# Altium schematic sheet STM32f407.SchDoc
size A3; SheetNumber: 10; SheetTotal: 12
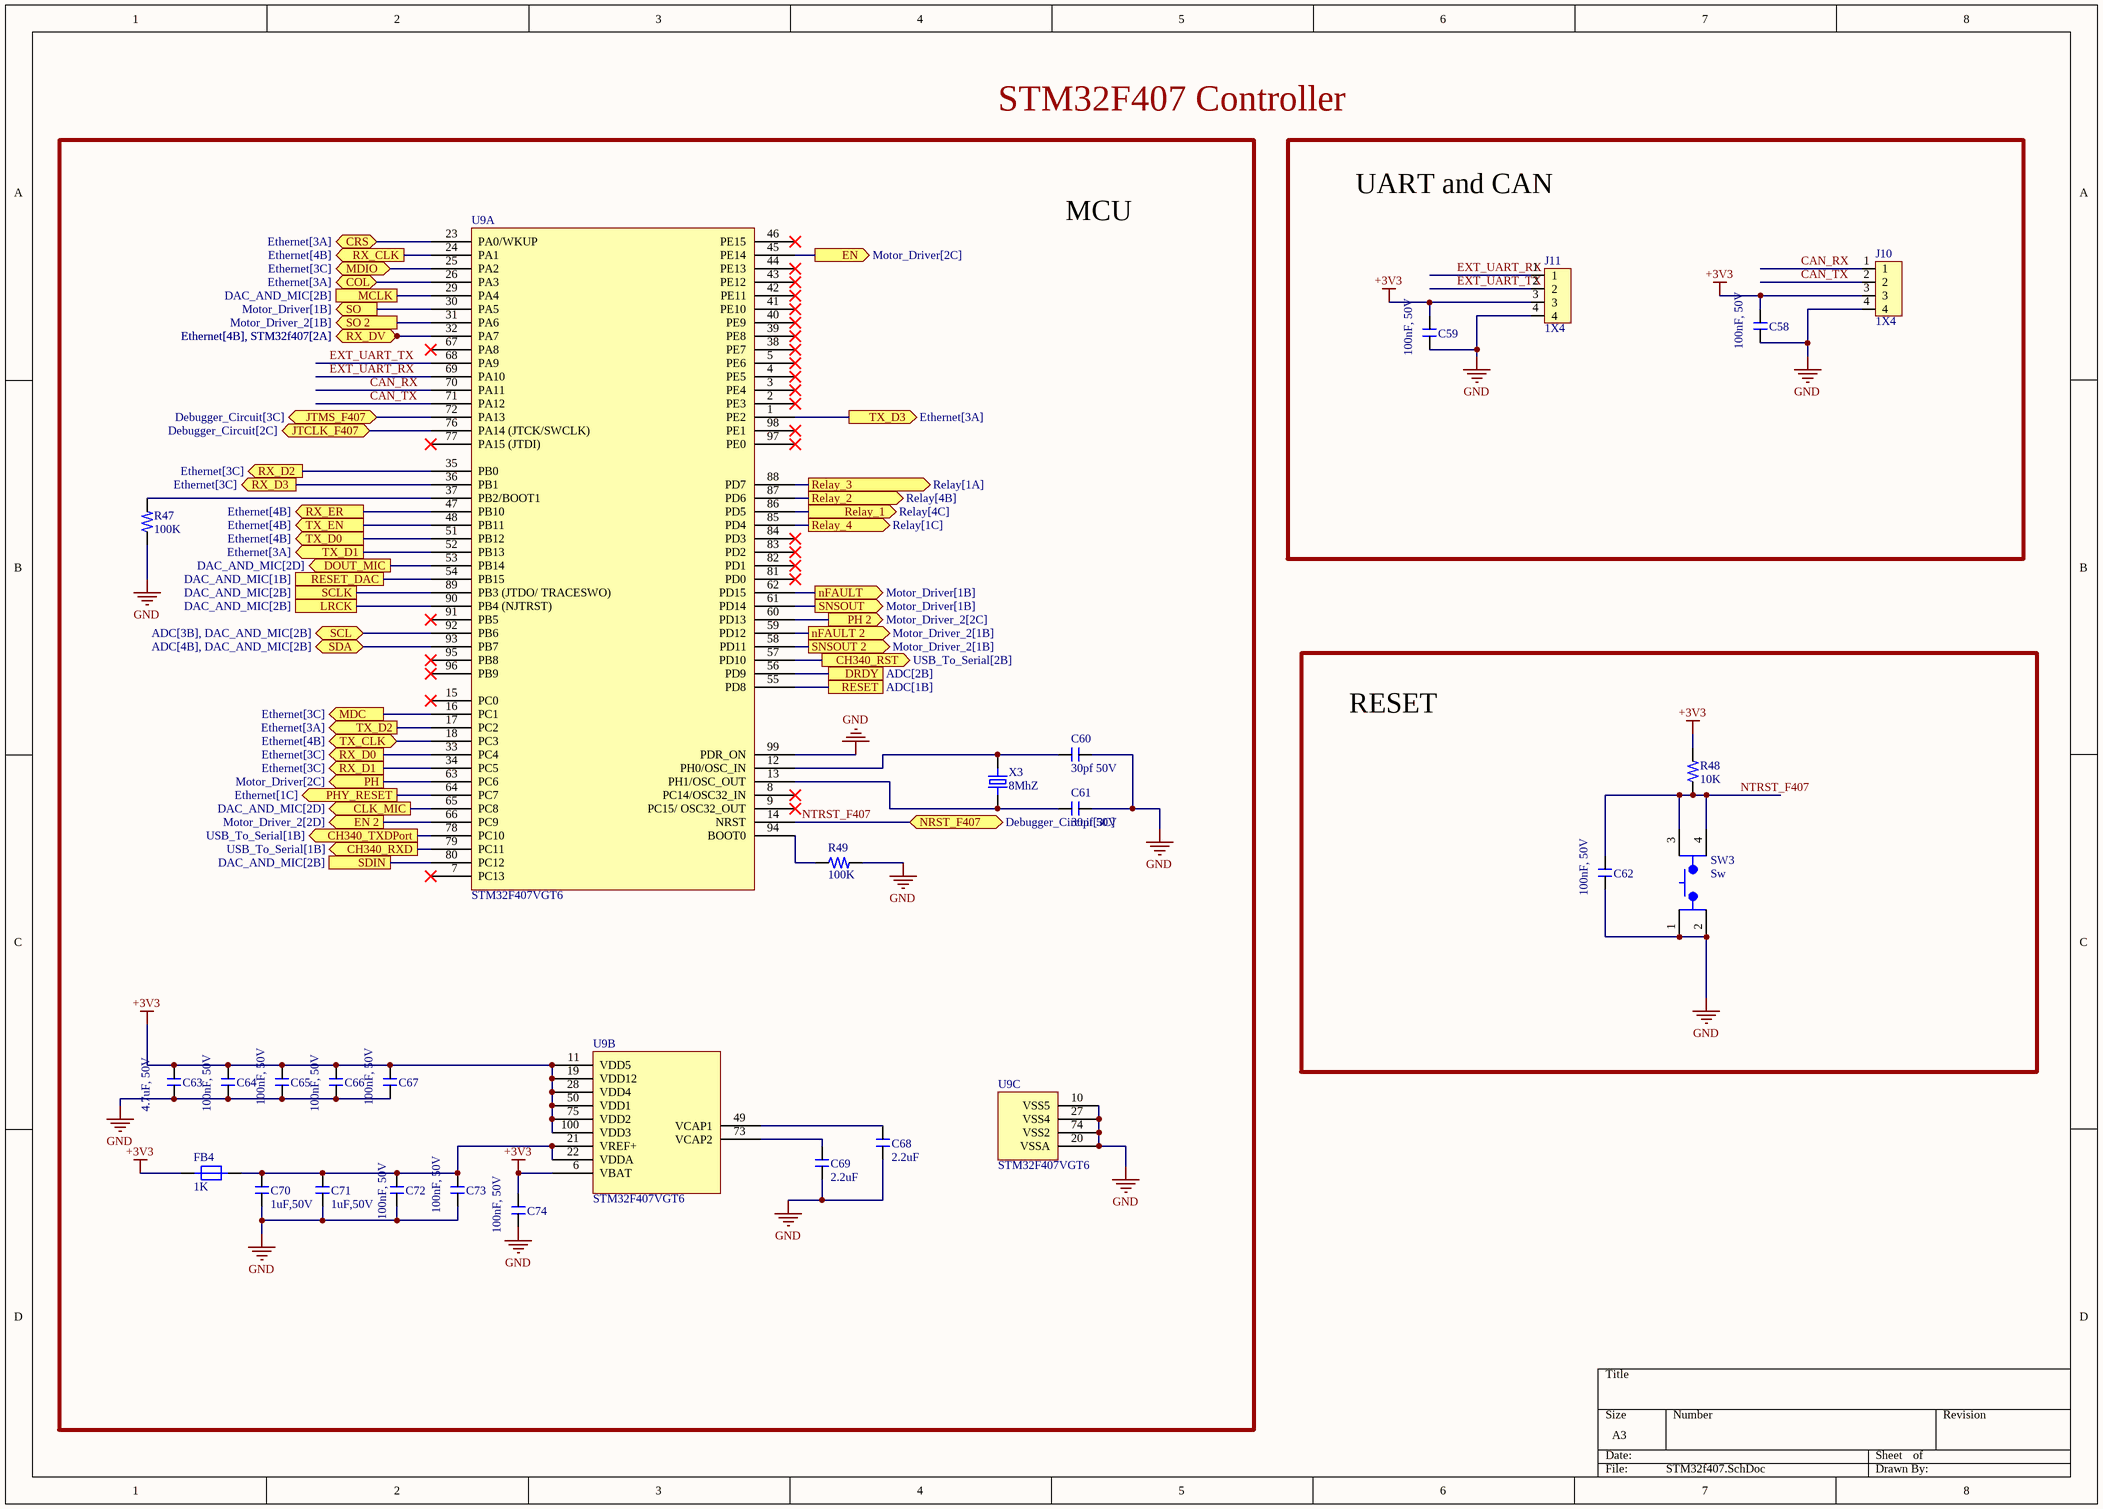
[diagram p0: STM32f407.SchDoc]

## Parts
C58  100nF, 50V  [Capacitor_0805]
C59  100nF, 50V  [Capacitor_0805]
C60  30pf 50V  [Capacitor_0805]
C61  30pf 50V  [Capacitor_0805]
C62  100nF, 50V  [Capacitor_0805]
C63  4.7uF, 50V  [Capacitor_0805]
C64  100nF, 50V  [Capacitor_0805]
C65  100nF, 50V  [Capacitor_0805]
C66  100nF, 50V  [Capacitor_0805]
C67  100nF, 50V  [Capacitor_0805]
C68  2.2uF  [Capacitor_0805]
C69  2.2uF  [Capacitor_0805]
C70  1uF,50V  [Capacitor_0805]
C71  1uF,50V  [Capacitor_0805]
C72  100nF, 50V  [Capacitor_0805]
C73  100nF, 50V  [Capacitor_0805]
C74  100nF, 50V  [Capacitor_0805]
FB4  1K  [FB_0805]
J10  1X4  [Header_1X4_2.54mm]
J11  1X4  [Header_1X4_2.54mm]
R47  100K  [Resistor_0603]
R48  10K  [Resistor_0603]
R49  100K  [Resistor_0603]
SW3  Sw  [SW_Tactile_SMD]
U9  STM32F407VGT6  [QFN100_19.6_669_58X10_SMD]  (parts A,B,C of 3)
X3  8MhZ  [XTAL_8MhZ]

## Blocks framed on the sheet
MCU: C60 C61 C63-C74 FB4 R47 R49 U9 X3
UART and CAN: C58 C59 J10 J11
RESET: C62 R48 SW3

## Ports
CH340_RST (out, see USB_To_Serial[2B]), CH340_RXD (out, see USB_To_Serial[1B]), CH340_TXDPort (out, see USB_To_Serial[1B]), CLK_MIC (out, see DAC_AND_MIC[2D]), COL (bidir, see Ethernet[3A]), CRS (bidir, see Ethernet[3A]), DOUT_MIC (out, see DAC_AND_MIC[2D]), DRDY (see ADC[2B]), EN 2 (out, see Motor_Driver_2[2D]), EN (out, see Motor_Driver[2C]), JTCLK_F407 (bidir, see Debugger_Circuit[2C]), JTMS_F407 (bidir, see Debugger_Circuit[3C]), LRCK (see DAC_AND_MIC[2B]), MCLK (see DAC_AND_MIC[2B]), MDC (out, see Ethernet[3C]), MDIO (bidir, see Ethernet[3C]), nFAULT 2 (out, see Motor_Driver_2[1B]), nFAULT (out, see Motor_Driver[1B]), NRST_F407 (bidir, see Debugger_Circuit[3C]), PH 2 (out, see Motor_Driver_2[2C]), PH (out, see Motor_Driver[2C]), PHY_RESET (out, see Ethernet[1C]), Relay_1 (out, see Relay[4C]), Relay_2 (out, see Relay[4B]), Relay_3 (out, see Relay[1A]), Relay_4 (out, see Relay[1C]), RESET (see ADC[1B]), RESET_DAC (see DAC_AND_MIC[1B]), RX_CLK (out, see Ethernet[4B]), RX_D0 (out, see Ethernet[3C]), RX_D1 (out, see Ethernet[3C]), RX_D2 (out, see Ethernet[3C]), RX_D3 (out, see Ethernet[3C]), RX_DV (bidir, see Ethernet[4B], STM32f407[2A]), RX_ER (out, see Ethernet[4B]), SCL (bidir, see ADC[3B], DAC_AND_MIC[2B]), SCLK (see DAC_AND_MIC[2B]), SDA (bidir, see ADC[4B], DAC_AND_MIC[2B]), SDIN (see DAC_AND_MIC[2B]), SNSOUT 2 (out, see Motor_Driver_2[1B]), SNSOUT (out, see Motor_Driver[1B]), SO 2 (out, see Motor_Driver_2[1B]), SO (out, see Motor_Driver[1B]), TX_CLK (bidir, see Ethernet[4B]), TX_D0 (out, see Ethernet[4B]), TX_D1 (out, see Ethernet[3A]), TX_D2 (out, see Ethernet[3A]), TX_D3 (out, see Ethernet[3A]), TX_EN (out, see Ethernet[4B])

## Nets
+3V3: C58.2 C59.2 C63.2 C64.2 C65.2 C66.2 C67.2 C74.2 FB4.1 J10.3 J11.3 R48.2 U9.6(VBAT) U9.11(VDD5) U9.19(VDD12) U9.28(VDD4) U9.50(VDD1) U9.75(VDD2) U9.100(VDD3)
GND: C58.1 C59.1 C60.1 C61.1 C62.1 C63.1 C64.1 C65.1 C66.1 C67.1 C68.1 C69.1 C70.1 C71.1 C72.1 C73.1 C74.1 J10.4 J11.4 R47.1 R49.2 SW3.1 SW3.2 U9.10(VSS5) U9.20(VSSA) U9.27(VSS4) U9.74(VSS2) U9.99(PDR_ON)
CAN_RX: J10.1 U9.70(PA11)
CAN_TX: J10.2 U9.71(PA12)
CH340_RST: U9.57(PD10) ; port CH340_RST
CH340_RXD: U9.79(PC11) ; port CH340_RXD
CH340_TXDPort: U9.78(PC10) ; port CH340_TXDPort
CLK_MIC: U9.65(PC8) ; port CLK_MIC
COL: U9.26(PA3) ; port COL
CRS: U9.23(PA0/WKUP) ; port CRS
DOUT_MIC: U9.53(PB14) ; port DOUT_MIC
DRDY: U9.56(PD9) ; port DRDY
EN: U9.45(PE14) ; port EN
EN 2: U9.66(PC9) ; port EN 2
EXT_UART_RX: J11.1 U9.69(PA10)
EXT_UART_TX: J11.2 U9.68(PA9)
JTCLK_F407: U9.76(PA14_(JTCK/SWCLK)) ; port JTCLK_F407
JTMS_F407: U9.72(PA13) ; port JTMS_F407
LRCK: U9.90(PB4_(NJTRST)) ; port LRCK
MCLK: U9.29(PA4) ; port MCLK
MDC: U9.16(PC1) ; port MDC
MDIO: U9.25(PA2) ; port MDIO
nFAULT: U9.62(PD15) ; port nFAULT
nFAULT 2: U9.59(PD12) ; port nFAULT 2
NTRST_F407: C62.2 R48.1 SW3.3 SW3.4 U9.14(NRST) ; port NRST_F407
PH: U9.63(PC6) ; port PH
PH 2: U9.60(PD13) ; port PH 2
PHY_RESET: U9.64(PC7) ; port PHY_RESET
Relay_1: U9.86(PD5) ; port Relay_1
Relay_2: U9.87(PD6) ; port Relay_2
Relay_3: U9.88(PD7) ; port Relay_3
Relay_4: U9.85(PD4) ; port Relay_4
RESET: U9.55(PD8) ; port RESET
RESET_DAC: U9.54(PB15) ; port RESET_DAC
RX_CLK: U9.24(PA1) ; port RX_CLK
RX_D0: U9.33(PC4) ; port RX_D0
RX_D1: U9.34(PC5) ; port RX_D1
RX_D2: U9.35(PB0) ; port RX_D2
RX_D3: U9.36(PB1) ; port RX_D3
RX_DV: U9.32(PA7) ; port RX_DV
RX_ER: U9.47(PB10) ; port RX_ER
SCL: U9.92(PB6) ; port SCL
SCLK: U9.89(PB3_(JTDO/_TRACESWO)) ; port SCLK
SDA: U9.93(PB7) ; port SDA
SDIN: U9.80(PC12) ; port SDIN
SNSOUT: U9.61(PD14) ; port SNSOUT
SNSOUT 2: U9.58(PD11) ; port SNSOUT 2
SO: U9.30(PA5) ; port SO
SO 2: U9.31(PA6) ; port SO 2
TX_CLK: U9.18(PC3) ; port TX_CLK
TX_D0: U9.51(PB12) ; port TX_D0
TX_D1: U9.52(PB13) ; port TX_D1
TX_D2: U9.17(PC2) ; port TX_D2
TX_D3: U9.1(PE2) ; port TX_D3
TX_EN: U9.48(PB11) ; port TX_EN
NetC60_2: C60.2 U9.12(PH0/OSC_IN) X3.2
NetC61_2: C61.2 U9.13(PH1/OSC_OUT) X3.1
NetC68_2: C68.2 U9.49(VCAP1)
NetC69_2: C69.2 U9.73(VCAP2)
NetC70_2: C70.2 C71.2 C72.2 C73.2 FB4.2 U9.21(VREF+) U9.22(VDDA)
NetR47_2: R47.2 U9.37(PB2/BOOT1)
NetR49_1: R49.1 U9.94(BOOT0)

Not connected (* = marked no-connect by the designer): U9 2(PE3)* 3(PE4)* 4(PE5)* 5(PE6)* 7(PC13)* 8(PC14/OSC32_IN)* 9(PC15/_OSC32_OUT)* 15(PC0)* 38(PE7)* 39(PE8)* 40(PE9)* 41(PE10)* 42(PE11)* 43(PE12)* 44(PE13)* 46(PE15)* 67(PA8)* 77(PA15_(JTDI))* 81(PD0)* 82(PD1)* 83(PD2)* 84(PD3)* 91(PB5)* 95(PB8)* 96(PB9)* 97(PE0)* 98(PE1)*

## Notes on the sheet
- STM32F407 Controller

## Library data of the parts
C58 C59 C62 C64-C67 C72-C74 = Cap_100nF_0805: Multilayer Ceramic Capacitor, 0.1 uF, 50 V, ï¿½ 10%, X7R, 0805 [2012 Metric]; Manufacturer: Samsung; Manufacturer Part Number: CL21B104KBCNNNC; Supplier: Digikey; Supplier Part Number: 1276-1003-1-ND; RoHS: Yes; Category: Ceramic Capacitors; Stock: 674609; Pricing: 1=0,08, 10=0,012, 100=0,0104, 1000=0,008 (USD); Mounting Technology: Surface Mount; Case/Package: 0805; Case Code (Metric): 2012; Case Code (Imperial): 0805; Material: Ceramic; Min Operating Temperature: -55°C; Max Operating Temperature: 125°C; Tolerance: 10%; Value: 100nF; Dielectric: X7R; Packaging: Tape and Reel; Voltage Rating: 50V; Voltage: 50V; Series: CL; Construction: Flat; Voltage Rating (DC): 50V; Length: 2mm; Width: 0.049inch; Height: 0.85mm; Depth: 1.25mm; Thickness: 0.037inch; Radiation Hardening: No; RoHS Compliant: Yes; Lead Free: 5697LeadFree; ComponentLink1URL: https://datasheet.ciiva.com/25710/cl21b104kbcnnnc-25710182.pdf?src-supplier=Digikey; ComponentLink1Description: https://datasheet.ciiva.com/25710/cl21b104kbcnnnc-25710182.pdf?src-supplier=Digikey; ComponentLink2URL: https://datasheet.ciiva.com/29199/454152-da-01-en-vs-kondensator-0805-29199814.pdf?src-supplier=Conrad; ComponentLink2Description: https://datasheet.ciiva.com/29199/454152-da-01-en-vs-kondensator-0805-29199814.pdf?src-supplier=Conrad
C60 C61 = Cap_30pf_0805: Capacitor, ceramic, 30Pf, 50Vdc, 10-% Tol, 10+% Tol, c0G-Tc Code, -30, 30Ppm-Tc Rohs Compliant: Yes; Manufacturer: KEMET; Manufacturer Part Number: C0805C300K5GACTU; Supplier: Mouser; Supplier Part Number: 80-C0805C300K5G; RoHS: Yes; Category: Ceramic Capacitors; Stock: 2572; Pricing: 1=0,27, 10=0,164, 50=0,164, 100=0,096, 1000=0,077, 10000=0,047 (USD); ComponentLink1URL: http://www.mouser.com/ds/2/212/KEM_C1003_C0G_SMD-1101588.pdf?src-supplier=Mouser; ComponentLink1Description: http://www.mouser.com/ds/2/212/KEM_C1003_C0G_SMD-1101588.pdf?src-supplier=Mouser; ComponentLink2URL: http://components.arrow.com/part/dataview/2091985S8614748N7429?src-supplier=Arrow+Electronics; ComponentLink2Description: http://components.arrow.com/part/dataview/2091985S8614748N7429?src-supplier=Arrow+Electronics; ComponentLink3URL: https://datasheet.octopart.com/C0805C300K5GACTU-KEMET-datasheet-149535491.pdf?src-supplier=Farnell; ComponentLink3Description: https://datasheet.octopart.com/C0805C300K5GACTU-KEMET-datasheet-149535491.pdf?src-supplier=Farnell; ComponentLink4URL: https://search.kemet.com/component-edge/download/datasheet/C0805C300K5GACTU.pdf?src-supplier=Digikey; ComponentLink4Description: https://search.kemet.com/component-edge/download/datasheet/C0805C300K5GACTU.pdf?src-supplier=Digikey
C63 = Cap_4.7uF_0805: Multilayer Ceramic Capacitor, 4.7 uF, 50 V, ï¿½ 10%, X5R, 0805 [2012 Metric]; Manufacturer: Murata; Manufacturer Part Number: GRM21BR61H475KE51L; Supplier: Mouser; Supplier Part Number: 81-GRM21BR61H475KE1L; RoHS: Yes; Category: Ceramic Capacitors; Stock: 172250; Pricing: 1=0,26, 10=0,141, 50=0,141, 100=0,086, 1000=0,083, 10000=0,071 (USD); Mounting Technology: Surface Mount; Case/Package: 0805; Case Code (Metric): 2012; Material: Ceramic; Case Code (Imperial): 0805; Min Operating Temperature: -55°C; Max Operating Temperature: 85°C; Packaging: Tape and Reel; Series: GRM; Value: 4.7uF; Tolerance: 10%; Dielectric: X5R; Voltage Rating: 50V; Voltage Rating (DC): 50V; Length: 2mm; Width: 0.049inch; Height: 1.25mm; Depth: 1.25mm; Thickness: 0.055inch; Reach SVHC Compliant: No; RoHS Compliant: Yes; Lead Free: 5697LeadFree; ComponentLink1URL: http://www.farnell.com/datasheets/2079186.pdf?src-supplier=Farnell; ComponentLink1Description: http://www.farnell.com/datasheets/2079186.pdf?src-supplier=Farnell; ComponentLink2URL: https://datasheet.octopart.com/GRM21BR61H475KE51L-Murata-datasheet-22122223.pdf?src-supplier=Future+Electronics; ComponentLink2Description: https://datasheet.octopart.com/GRM21BR61H475KE51L-Murata-datasheet-22122223.pdf?src-supplier=Future+Electronics; ComponentLink3URL: http://www.farnell.com/datasheets/2079186.pdf?src-supplier=Element14; ComponentLink3Description: http://www.farnell.com/datasheets/2079186.pdf?src-supplier=Element14; ComponentLink4URL: https://datasheet.octopart.com/GRM21BR61H475KE51L-Murata-datasheet-66077112.pdf?src-supplier=Element14; ComponentLink4Description: https://datasheet.octopart.com/GRM21BR61H475KE51L-Murata-datasheet-66077112.pdf?src-supplier=Element14; ComponentLink5URL: http://search.murata.co.jp/Ceramy/image/img/A01X/G101/ENG/GRM21BR61H475KE51-01.pdf?src-supplier=Digikey; ComponentLink5Description: http://search.murata.co.jp/Ceramy/image/img/A01X/G101/ENG/GRM21BR61H475KE51-01.pdf?src-supplier=Digikey; ComponentLink6URL: https://search.murata.co.jp/Ceramy/image/img/A01X/G101/ENG/GRM21BR61H475KE51-01.pdf?src-supplier=Digikey; ComponentLink6Description: https://search.murata.co.jp/Ceramy/image/img/A01X/G101/ENG/GRM21BR61H475KE51-01.pdf?src-supplier=Digikey
C68 C69 = CAP_2.2uF_0805: Multilayer Ceramic Capacitor, 2.2 uF, 25 V, ± 10%, X7R, 0805 [2012 Metric]; Manufacturer: Samsung; Manufacturer Part Number: CL21B225KAFNFNE; Supplier: Arrow Electronics; Supplier Part Number: CL21B225KAFNFNE; RoHS: Yes; Category: Ceramic Capacitors; Stock: 1124000; Pricing: 4000=0,0243, 6000=0,0241, 10000=0,0171, 14000=0,0169, 20000=0,0168, 50000=0,0155, 100000=0,0153, 200000=0,015 (USD); ComponentLink1URL: https://datasheet.ciiva.com/25798/cl21b225kafnfne-25798721.pdf?src-supplier=Digikey; ComponentLink1Description: https://datasheet.ciiva.com/25798/cl21b225kafnfne-25798721.pdf?src-supplier=Digikey
C70 C71 = Cap_1uF_0805: 0805 1 uF 50 V ±5 % Tolerance X7R Surface Mount Multilayer Ceramic Capacitor; Manufacturer: Yageo; Manufacturer Part Number: CC0805JKX7R9BB105; Material: 4241ConductorMaterial; Dielectric: 1511DielectricType; Supplier: Digikey; Supplier Part Number: 311-3498-1-ND; RoHS: Yes; Category: Ceramic Capacitors; Stock: 30160; Pricing: 1=0,29, 10=0,168, 100=0,1077, 1000=0,07673 (USD); Voltage Rating (DC): 50V; Height: 1.45mm; Lead Free: 5697LeadFree; Halogen Free: 5694HalogenFree; ComponentLink1URL: https://datasheet.octopart.com/CC0805JKX7R9BB105-Yageo-datasheet-137700082.pdf?src-supplier=Future+Electronics; ComponentLink1Description: https://datasheet.octopart.com/CC0805JKX7R9BB105-Yageo-datasheet-137700082.pdf?src-supplier=Future+Electronics; ComponentLink2URL: http://www.yageo.com/documents/recent/UPY-GPHC_X7R_6.3V-to-50V_18.pdf?src-supplier=Digikey; ComponentLink2Description: http://www.yageo.com/documents/recent/UPY-GPHC_X7R_6.3V-to-50V_18.pdf?src-supplier=Digikey; ComponentLink3URL: https://datasheet.octopart.com/CC0805JKX7R9BB105-Yageo-datasheet-151948686.pdf?src-supplier=Farnell; ComponentLink3Description: https://datasheet.octopart.com/CC0805JKX7R9BB105-Yageo-datasheet-151948686.pdf?src-supplier=Farnell
FB4 = FB_BLM21SP102SH1D: Ferrite Beads Multi-Layer High Current 1KOhm 25% 100MHz 1.6A 0.12Ohm DCR 0805 Automotive T/R; Manufacturer: Murata; Core Material: 228ConductorMaterial; Value: 120mR; Supplier: Mouser; Supplier Part Number: 81-BLM21SP102SH1D; Manufacturer Part Number: BLM21SP102SH1D; RoHS: Yes; Category: Ferrite Beads and Chips; Stock: 4751; Pricing: 1=0,33, 10=0,179, 50=0,179, 100=0,159, 1000=0,105, 10000=0,083 (USD); RMS Current (Irms): 1.6A; ESR: 120mR; Test Frequency: 100MHz; Tolerance: 25%; Height: 1.05mm; ComponentLink1URL: https://datasheet.octopart.com/BLM21SP102SH1D-Murata-datasheet-138707452.pdf?src-supplier=Future+Electronics; ComponentLink1Description: https://datasheet.octopart.com/BLM21SP102SH1D-Murata-datasheet-138707452.pdf?src-supplier=Future+Electronics; ComponentLink2URL: https://www.murata.com/en-us/api/pdfdownloadapi?cate=luNoiseSupprFilteChipFerriBead&amp;partno=BLM21SP102SH1%23&src-supplier=Digikey; ComponentLink2Description: https://www.murata.com/en-us/api/pdfdownloadapi?cate=luNoiseSupprFilteChipFerriBead&amp;partno=BLM21SP102SH1%23&src-supplier=Digikey; ComponentLink3URL: https://datasheet.octopart.com/BLM21SP102SH1D-Murata-datasheet-166171483.pdf?src-supplier=TME; ComponentLink3Description: https://datasheet.octopart.com/BLM21SP102SH1D-Murata-datasheet-166171483.pdf?src-supplier=TME
J10 J11 = Header_Male_1X4_2.54: THT Vertical Pin Header WR-PHD, Pitch 2.54 mm, Single Row, 4 pins; Manufacturer: Wurth Electronics; Manufacturer Part Number: 61300411121; Number of Positions: 4; Gender: 29Gender; Contact Resistance: 20mR; Current Rating: 3A; Operating Supply Voltage: 250V; Pitch: 0.1inch; Supplier: Digikey; Supplier Part Number: 732-5317-ND; RoHS: Yes; Category: Headers and Wire Housings; Stock: 28749; Pricing: 1=0,17, 10=0,147, 25=0,1216, 50=0,1018, 100=0,0918, 1000=0,085 (USD); Mounting Technology: Through Hole; Contact Plating: Gold; Contact Material: Copper; Color: Black; Min Operating Temperature: -40°C; Max Operating Temperature: 105°C; Number of Rows: 1; Packaging: Bulk; Termination: Solder; Number of Contacts: 4; Series: WR-PHD; Contact Type: Male Pin; Voltage Rating: 250V; Orientation: 5495OrientationType; Height: 8.89mm; Contact Mating Length: 0.236inch; RoHS Compliant: Yes; Reach SVHC Compliant: Unknown; Lead Free: 5697LeadFree; ComponentLink1URL: http://www.farnell.com/cad/1737268.pdf?src-supplier=Element14; ComponentLink1Description: http://www.farnell.com/cad/1737268.pdf?src-supplier=Element14; ComponentLink2URL: https://datasheet.octopart.com/61300411121-W%C3%BCrth-Elektronik-datasheet-21154836.pdf?src-supplier=Element14; ComponentLink2Description: https://datasheet.octopart.com/61300411121-W%C3%BCrth-Elektronik-datasheet-21154836.pdf?src-supplier=Element14; ComponentLink3URL: https://katalog.we-online.de/em/datasheet/6130xx11121.pdf?src-supplier=Digikey; ComponentLink3Description: https://katalog.we-online.de/em/datasheet/6130xx11121.pdf?src-supplier=Digikey
R47 R49 = R_100K_0603: Res Thick Film 0603 100K Ohm 1% 0.1W(1/10W) ±100ppm/C Pad SMD Automotive T/R; Manufacturer: Stackpole Electronics; Manufacturer Part Number: RMCF0603FT100K; Value: 100kR; Max Power Dissipation: 100mW; Temperature Coefficient: 100ppm/°C; Voltage Rating: 75V; Supplier: Digikey; Supplier Part Number: RMCF0603FT100KCT-ND; RoHS: Yes; Category: Chip SMD Resistors; Stock: 722640; Pricing: 1=0,1, 10=0,02, 100=0,0091, 1000=0,0048, 2500=0,00386 (USD); Mounting Technology: Surface Mount; Case/Package: 0603; Case Code (Metric): 1608; Case Code (Imperial): 0603; Contact Plating: Tin,Matte; Min Operating Temperature: -55°C; Max Operating Temperature: 155°C; Tolerance: 1%; Packaging: Tape and Reel; Number of Terminations: 2; Features: Automotive AEC-Q200; Series: RMCF; Construction: Rectangular; Length: 1.55mm; Width: 0.031inch; Height: 0.022inch; Depth: 0.8mm; Radiation Hardening: No; Military Standard: Not; RoHS Compliant: Yes; Lead Free: 5697LeadFree; ComponentLink1URL: https://datasheet.ciiva.com/15193/getdatasheetpartid-362597-15193437.pdf?src-supplier=Verical; ComponentLink1Description: https://datasheet.ciiva.com/15193/getdatasheetpartid-362597-15193437.pdf?src-supplier=Verical
R48 = R_10K_0603: SMD Chip Resistor, 10 kOhm, ï¿½ 1%, 100 mW, 0603 [1608 Metric], Thick Film, General Purpose; Manufacturer: Yageo; Manufacturer Part Number: RC0603FR-0710KL; Voltage Rating (DC): 50V; Value: 10kR; Temperature Coefficient: 100ppm/°C; Voltage Rating: 75V; Power Rating: 100mW; Supplier: Digikey; Supplier Part Number: 311-10.0KHRCT-ND; RoHS: Yes; Category: Chip SMD Resistors; Stock: 2808060; Pricing: 1=0,1, 10=0,009, 100=0,0071, 1000=0,00612 (USD); Case/Package: 0603; Pins: 2; Case Code (Imperial): 0603; Case Code (Metric): 1608; Weight: 7.1E-05oz; Min Operating Temperature: -55°C; Max Operating Temperature: 155°C; Tolerance: 1%; Resistor Type: Thick Film; Packaging: Tape and Reel; Termination: SMD/SMT; Features: Moisture Resistant; Series: RC; Max Power Dissipation: 100mW; Number of Terminations: 2; Resistance Tolerance: 1%; Construction: Rectangular; Length: 1.6mm; Width: 0.8mm; Height: 0.45mm; Depth: 0.8mm; Lead Pitch: 0.3mm; Reach SVHC Compliant: No; Lead Free: 5697LeadFree; RoHS Compliant: Yes; Military Standard: Not; ComponentLink1URL: https://datasheet.ciiva.com/7660/38590-7660789.pdf?src-supplier=Element14; ComponentLink1Description: https://datasheet.ciiva.com/7660/38590-7660789.pdf?src-supplier=Element14; ComponentLink2URL: https://datasheet.ciiva.com/7983/443971-7983596.pdf?src-supplier=Element14; ComponentLink2Description: https://datasheet.ciiva.com/7983/443971-7983596.pdf?src-supplier=Element14; ComponentLink3URL: https://datasheet.ciiva.com/22747/443971-22747519.pdf?src-supplier=Element14; ComponentLink3Description: https://datasheet.ciiva.com/22747/443971-22747519.pdf?src-supplier=Element14; ComponentLink4URL: https://datasheet.ciiva.com/46440/1868787-46440891.pdf?src-supplier=Element14; ComponentLink4Description: https://datasheet.ciiva.com/46440/1868787-46440891.pdf?src-supplier=Element14; ComponentLink5URL: https://datasheet.ciiva.com/7746/1738695-7746239.pdf?src-supplier=Element14; ComponentLink5Description: https://datasheet.ciiva.com/7746/1738695-7746239.pdf?src-supplier=Element14; ComponentLink6URL: https://datasheet.ciiva.com/15189/getdatasheetpartid-409289-15189591.pdf?src-supplier=Verical; ComponentLink6Description: https://datasheet.ciiva.com/15189/getdatasheetpartid-409289-15189591.pdf?src-supplier=Verical
SW3 = SW_Tactile_SPST: TL3305A Series SPST 12 V 4.5 x 4.5 mm 260 gf Top Actuated SMT Tactile Switch; Manufacturer: E-Switch; Manufacturer Part Number: TL3305AF260QG; Mechanical Life: 200000Cycles; Illumination Type: Non-Illuminated; Operating Force: 260gf; Switch Travel: 0.2mm; Switch Function: Off-Mom; Actuator Type: Standard; Supplier: Digikey; Supplier Part Number: EG5353CT-ND; RoHS: No; Category: Tactile Switches; Stock: 97166; Pricing: 1=0,2, 10=0,176, 25=0,1664, 100=0,153, 250=0,14456, 500=0,1385, 1000=0,13264 (USD); Mounting Technology: Surface Mount; Min Operating Temperature: -20°C; Max Operating Temperature: 70°C; Packaging: Cut Tape; Termination: Gull Wing; Throw Configuration: SPST; Series: TL3305; Lead Free: Lead Free; ComponentLink1URL: http://www.farnell.com/datasheets/2554191.pdf?src-supplier=Farnell; ComponentLink1Description: http://www.farnell.com/datasheets/2554191.pdf?src-supplier=Farnell; ComponentLink2URL: http://www.farnell.com/datasheets/2554191.pdf?src-supplier=Newark; ComponentLink2Description: http://www.farnell.com/datasheets/2554191.pdf?src-supplier=Newark; ComponentLink3URL: http://spec_sheets.e-switch.com/specs/P010471.pdf?src-supplier=Mouser; ComponentLink3Description: http://spec_sheets.e-switch.com/specs/P010471.pdf?src-supplier=Mouser; ComponentLink4URL: http://www.farnell.com/datasheets/2554191.pdf?src-supplier=Element14; ComponentLink4Description: http://www.farnell.com/datasheets/2554191.pdf?src-supplier=Element14; ComponentLink5URL: http://spec_sheets.e-switch.com/specs/P010471.pdf?src-supplier=Digikey; ComponentLink5Description: http://spec_sheets.e-switch.com/specs/P010471.pdf?src-supplier=Digikey; ComponentLink6URL: http://spec_sheets.e-switch.com/specs/P010471.pdf?src-supplier=NAC+Semi; ComponentLink6Description: http://spec_sheets.e-switch.com/specs/P010471.pdf?src-supplier=NAC+Semi
U9 = IC_STM32F407VGT6: ARM® Cortex®-M4 STM32F4 Microcontroller IC 32-Bit 168MHz 1MB (1M x 8) FLASH 100-LQFP (14x14); Manufacturer: STMicroelectronics; Alternate Part Number-1: STM32F407VET6; Manufacturer Part Number: STM32F407VGT6; Case/Package: LQFP100; Supplier-1: ARROW; Supplier Part Number-1: STM32F407VGT6
X3 = Xtal_8MHz: Crystal 8MHz ±30ppm (Tol) ±50ppm (Stability) 32pF FUND 60Ohm 2-Pin HC-49/USX SMD T/R; Manufacturer: ECS International; Manufacturer Part Number: ECS-80-32-5PX-TR; Supplier: Digikey; Supplier Part Number: XC1272CT-ND; RoHS: Yes; Category: Crystals; Stock: 6065; Pricing: 1=0,3, 10=0,259, 50=0,235, 100=0,2252, 500=0,20416 (USD); ComponentLink1URL: https://datasheet.ciiva.com/852/csm-7x-852413.pdf?src-supplier=Digikey; ComponentLink1Description: https://datasheet.ciiva.com/852/csm-7x-852413.pdf?src-supplier=Digikey; ComponentLink2URL: https://datasheet.ciiva.com/852/csm-7x-852414.pdf?src-supplier=Digikey; ComponentLink2Description: https://datasheet.ciiva.com/852/csm-7x-852414.pdf?src-supplier=Digikey; ComponentLink3URL: https://datasheet.ciiva.com/852/csm-7x-852415.pdf?src-supplier=Digikey; ComponentLink3Description: https://datasheet.ciiva.com/852/csm-7x-852415.pdf?src-supplier=Digikey